# Altium schematic sheet io_bank.SchDoc
size A
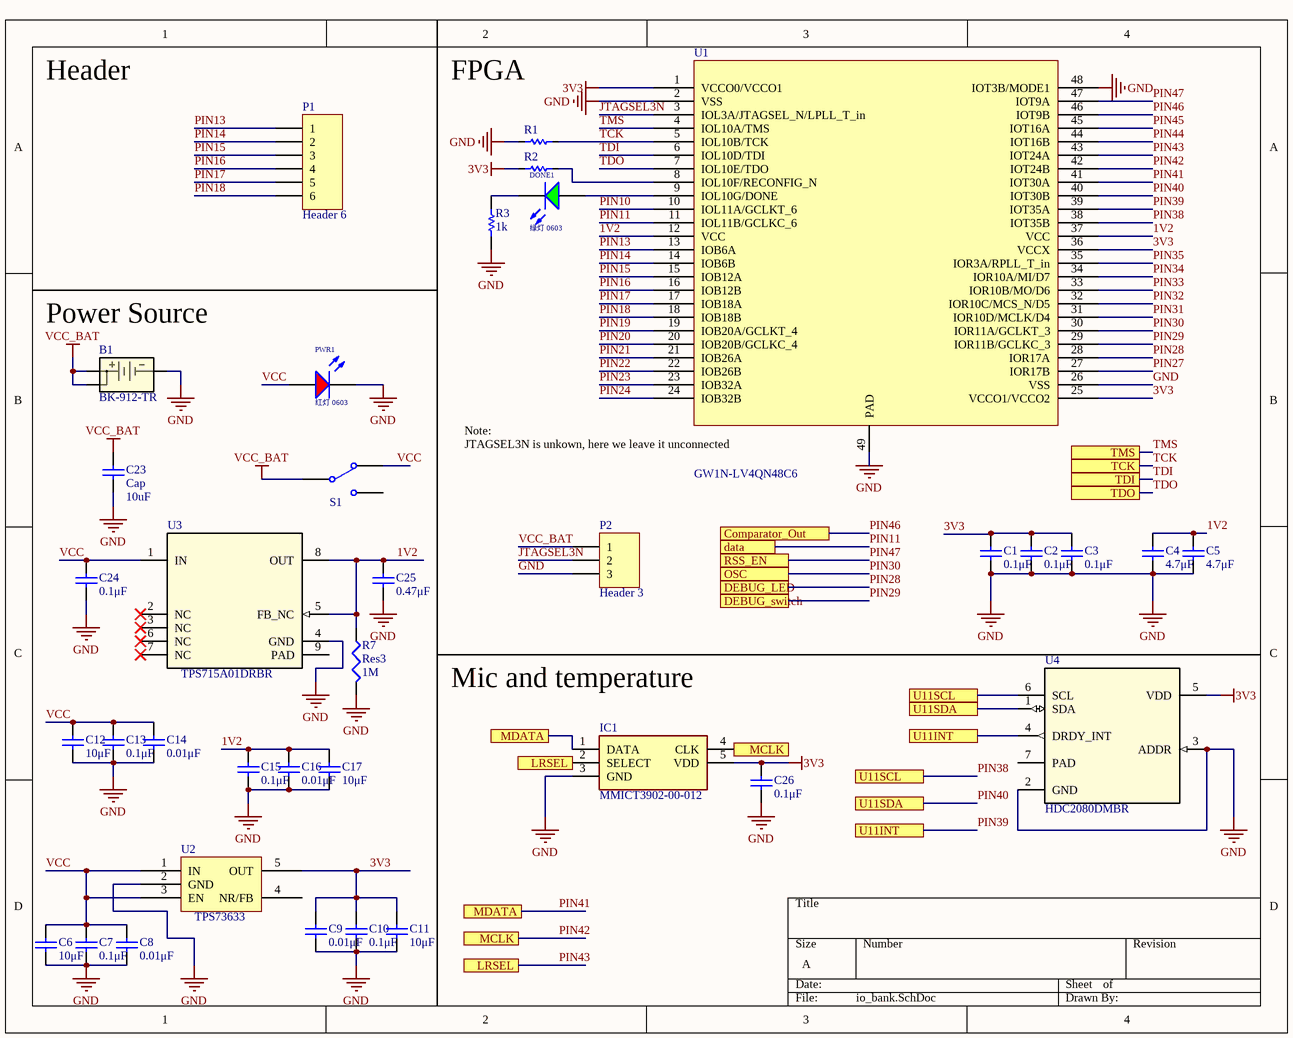
[diagram p0: io_bank.SchDoc]

## Parts
B1  BK-912-TR  [BK-912-TR_MPD]
C1  0.1μF  [1608[0603]]
C2  0.1μF  [1608[0603]]
C3  0.1μF  [1608[0603]]
C4  4.7μF  [1608[0603]]
C5  4.7μF  [1608[0603]]
C6  10μF  [1608[0603]]
C7  0.1μF  [1608[0603]]
C8  0.01μF  [1608[0603]]
C9  0.01μF  [1608[0603]]
C10  0.1μF  [1608[0603]]
C11  10μF  [1608[0603]]
C12  10μF  [1608[0603]]
C13  0.1μF  [1608[0603]]
C14  0.01μF  [1608[0603]]
C15  0.1μF  [1608[0603]]
C16  0.01μF  [1608[0603]]
C17  10μF  [1608[0603]]
C23  Cap  value 10uF  [1608[0603]]
C24  0.1μF  [1608[0603]]
C25  0.47μF  [1608[0603]]
C26  0.1μF  [1608[0603]]
DONE1  绿灯 0603  [0603_LED]
IC1  MMICT3902-00-012  [MMICT390200012]
P1  Header 6  [HDR1X6]
P2  Header 3  [HDR1X3]
PWR1  红灯 0603  [0603_LED]
R1  4.7k  [1608[0603]]  (value not drawn)
R2  4.7k  [1608[0603]]  (value not drawn)
R3  value 1k  [1608[0603]]  (hidden comment: 1k Ohm)
R7  Res3  value 1M  [J1-0603]
S1  SW-SPDT  [SW_SPDT]  (value not drawn)
U1  GW1N-LV4QN48C6  [QFN40P600X600X60_HS-49N]
U2  TPS73633  [TPS73633]
U3  TPS715A01DRBR  [DRB0008A]
U4  HDC2080DMBR  [DMB0006A]

## Ports
Comparator_Out, data, DEBUG_LED, DEBUG_switch, LRSEL, MCLK, MDATA, OSC, RSS_EN, TCK, TDI, TDO, TMS, U11INT, U11SCL, U11SDA

## Nets
3V3: C1.2 C2.2 C3.2 C9.2 C10.2 C11.2 C26.2 IC1.5(VDD) R2.1 U1.1(VCCO0/VCCO1) U1.25(VCCO1/VCCO2) U1.36(VCCX) U2.5(OUT) U4.5(VDD)
GND: B1.3 C1.1 C2.1 C3.1 C4.1 C5.1 C6.1 C7.1 C8.1 C9.1 C10.1 C11.1 C12.1 C13.1 C14.1 C15.1 C16.1 C17.1 C23.1 C24.1 C25.1 C26.1 IC1.3(GND) P2.3 PWR1.K R1.1 R3.1 R7.2 U1.2(VSS) U1.26(VSS) U1.48(IOT3B/MODE1) U1.49(PAD) U2.2(GND) U3.4(GND) U4.2(GND) U4.3(ADDR)
VCC_BAT: B1.1 B1.2 C23.2 P2.1 S1.2
1V2: C4.2 C5.2 C15.2 C16.2 C17.2 C25.2 R7.1 U1.12(VCC) U1.37(VCC) U3.5(FB_NC) U3.8(OUT)
JTAGSEL3N: P2.2 U1.3(IOL3A/JTAGSEL_N/LPLL_T_in)
PIN10: U1.10(IOL11A/GCLKT_6)
PIN11: U1.11(IOL11B/GCLKC_6) ; port data
PIN13: P1.1 U1.13(IOB6A)
PIN14: P1.2 U1.14(IOB6B)
PIN15: P1.3 U1.15(IOB12A)
PIN16: P1.4 U1.16(IOB12B)
PIN17: P1.5 U1.17(IOB18A)
PIN18: P1.6 U1.18(IOB18B)
PIN19: U1.19(IOB20A/GCLKT_4)
PIN20: U1.20(IOB20B/GCLKC_4)
PIN21: U1.21(IOB26A)
PIN22: U1.22(IOB26B)
PIN23: U1.23(IOB32A)
PIN24: U1.24(IOB32B)
PIN27: U1.27(IOR17B)
PIN28: U1.28(IOR17A) ; port DEBUG_LED
PIN29: U1.29(IOR11B/GCLKC_3) ; port DEBUG_switch
PIN30: U1.30(IOR11A/GCLKT_3) ; port OSC
PIN31: U1.31(IOR10D/MCLK/D4)
PIN32: U1.32(IOR10C/MCS_N/D5)
PIN33: U1.33(IOR10B/MO/D6)
PIN34: U1.34(IOR10A/MI/D7)
PIN35: U1.35(IOR3A/RPLL_T_in)
PIN38: U1.38(IOT35B) U4.6(SCL) ; port U11SCL
PIN39: U1.39(IOT35A) U4.4(DRDY_INT) ; port U11INT
PIN40: U1.40(IOT30B) U4.1(SDA) ; port U11SDA
PIN41: IC1.1(DATA) U1.41(IOT30A) ; port MDATA
PIN42: IC1.4(CLK) U1.42(IOT24B) ; port MCLK
PIN43: IC1.2(SELECT) U1.43(IOT24A) ; port LRSEL
PIN44: U1.44(IOT16B)
PIN45: U1.45(IOT16A)
PIN46: U1.46(IOT9B) ; port Comparator_Out
PIN47: U1.47(IOT9A) ; port RSS_EN
TCK: R1.2 U1.5(IOL10B/TCK) ; port TCK
TDI: U1.6(IOL10D/TDI) ; port TDI
TDO: U1.7(IOL10E/TDO) ; port TDO
TMS: U1.4(IOL10A/TMS) ; port TMS
VCC: C6.2 C7.2 C8.2 C12.2 C13.2 C14.2 C24.2 PWR1.A S1.3 U2.1(IN) U2.3(EN) U3.1(IN)
NetDONE1_A: DONE1.A U1.9(IOL10G/DONE)
NetDONE1_K: DONE1.K R3.2
NetR2_2: R2.2 U1.8(IOL10F/RECONFIG_N)

Not connected (* = marked no-connect by the designer): S1 1; U2 4(NR/FB); U3 2(NC)* 3(NC)* 6(NC)* 7(NC)* 9(PAD); U4 7(PAD)

## Notes on the sheet
- Header
- FPGA
- (near B1) Power Source
- (near U1) JTAGSEL3N is unkown, here we leave it unconnected
- Note:
- Mic and temperature

## Library data of the parts
B1 = BK-912-TR: No Description Available; Vendor: Memory Protection Devices, Inc; Built_By: EMA_Cory; SourceLibrary: Memory_Protection_Devices_2020-01-22; VALUE_2: Value; Datasheet: https://www.memoryprotectiondevices.com/datasheets/BK-912-datasheet.pdf; Manufacturer_Part_Number: BK-912-TR; Copyright: Copyright (C) 2018 Accelerated Designs. All rights reserved; RefDes: RefDes; Type: DEV
C1-C5 C7 C10 C13 C15 C24-C26 = CAP_2: MLCCs; Value: 100pF; Published: 8-Jun-2000; LatestRevisionDate: 17-Jul-2002; LatestRevisionNote: Re-released for DXP Platform.; PackageReference: RAD-0.3; Publisher: Altium Limited; PackageDescription: Radial Cap, Thru-Hole; 2 Leads; 0.3 in Pin Spacing
C6 C11 C12 C17 = CAP_4: MLCCs; Value: 100pF; Published: 8-Jun-2000; LatestRevisionDate: 17-Jul-2002; LatestRevisionNote: Re-released for DXP Platform.; PackageReference: RAD-0.3; Publisher: Altium Limited; PackageDescription: Radial Cap, Thru-Hole; 2 Leads; 0.3 in Pin Spacing
C8 C9 C14 C16 = CAP_3: MLCCs; Value: 100pF; Published: 8-Jun-2000; LatestRevisionDate: 17-Jul-2002; LatestRevisionNote: Re-released for DXP Platform.; PackageReference: RAD-0.3; Publisher: Altium Limited; PackageDescription: Radial Cap, Thru-Hole; 2 Leads; 0.3 in Pin Spacing
C23 = Cap: Capacitor; Published: 8-Jun-2000; LatestRevisionDate: 17-Jul-2002; LatestRevisionNote: Re-released for DXP Platform.; PackageReference: RAD-0.3; Publisher: Altium Limited; PackageDescription: Radial Cap, Thru-Hole; 2 Leads; 0.3 in Pin Spacing
DONE1 = 0603 绿灯: 发光二极管; ComponentLink1Description: 供应商链接; ComponentLink1URL: http://www.szlcsc.com/product/details_73152.html; Package: 0603; Supplier: LC; SuppliersPartNumber: C72043
IC1 = MMICT3902-00-012: Integrated Circuit; Manufacturer_Name: TDK; Datasheet Link: http://invensense.tdk.com/wp-content/uploads/2020/05/DS-000357-T3902-v1.0.pdf; Height: 1.13mm; Manufacturer_Part_Number: MMICT3902-00-012
P1 = Header 6: Header, 6-Pin; LatestRevisionDate: 17-Jul-2002; LatestRevisionNote: Re-released for DXP Platform.; Publisher: Altium Limited
P2 = Header 3: Header, 3-Pin; LatestRevisionDate: 17-Jul-2002; LatestRevisionNote: Re-released for DXP Platform.; Publisher: Altium Limited
PWR1 = 0603 红灯: 发光二极管; ComponentLink1Description: 供应商链接; ComponentLink1URL: http://www.szlcsc.com/product/details_2659.html; Package: 0603; Supplier: LC; SuppliersPartNumber: C2286
R1 R2 = RES_1: Resistor; Value: 1K; Published: 8-Jun-2000; LatestRevisionDate: 17-Jul-2002; LatestRevisionNote: Re-released for DXP Platform.; PackageReference: AXIAL-0.3; Publisher: Altium Limited; PackageDescription: Axial Device, Thru-Hole; 2 Leads; 0.3 in Pin Spacing
R3 = Res: Chip Resistor (Surface Mount); Manufacturer: Generic Chip Res (TBD); Manufacturer Part Number: *; Digi-Key Part Number: *; Rating: *
R7 = Res3: Resistor; Published: 8-Jun-2000; LatestRevisionDate: 29-May-2009; LatestRevisionNote: IPC-7351 Footprint Added.; PackageReference: J1-0603; Publisher: Altium Limited; PackageDescription: Chip Resistor
S1 = SW-SPDT: Single Pole Double Throw Subminiature Toggle Switch, Right Angle Mounting, Vertical Actuation; Published: 24-Mar-1999; LatestRevisionDate: 17-Dec-2003; LatestRevisionNote: Schematic revised, PCB Footprint replaced.; DatasheetDocument: 05-Dec-2000; PackageReference: TL36WW15050; Publisher: Altium Limited; ComponentLink1Description: Manufacturer Link; ComponentLink1URL: http://www.apem.com
U3 = TPS715A01DRBR: No Description Available; Mfr_Name: Texas Instruments; Alternate_PartNumber: TPS715A01DRBT; CompType: IC; Type: DEV; RefDes: RefDes; Copyright: Copyright (C) 2021 Ultra Librarian. All rights reserved.; Manufacturer_Part_Number: TPS715A01DRBR; Application_BuildNumber: *; PartNumber: TPS715A01DRBR; PackageReference: DRB0008A; MountType: SMT; RoHS: Y; Manufacturer: Texas Instruments
U4 = HDC2080DMBR: No Description Available; Manufacturer: Texas Instruments; PartNumber: HDC2080DMBR; RefDes: RefDes; Type: DEV; Value: Value; Copyright: Copyright (C) 2018 Accelerated Designs. All rights reserved